# Altium schematic sheet Eload Gen 3 Control Module Rev 2.SchDoc
size A1; PageSetup: Record=PageOptions|CenterHorizontal=True|CenterVertical=True|PrintScale=1.00|XCorrection=1.00|YCorrection=1.00|PrintKind=1|BorderSize=5000000|LeftOffset=0|BottomOffset=0|Orientation=2|PaperLength=1000|PaperWidth=1000|Scale=100|PaperSource=7|PrintQuality=-3|MediaType=1|DitherType=10|PrintScaleMode=1|PaperKind=Letter 8.5"x11" 22x28cm|PaperIndex=1
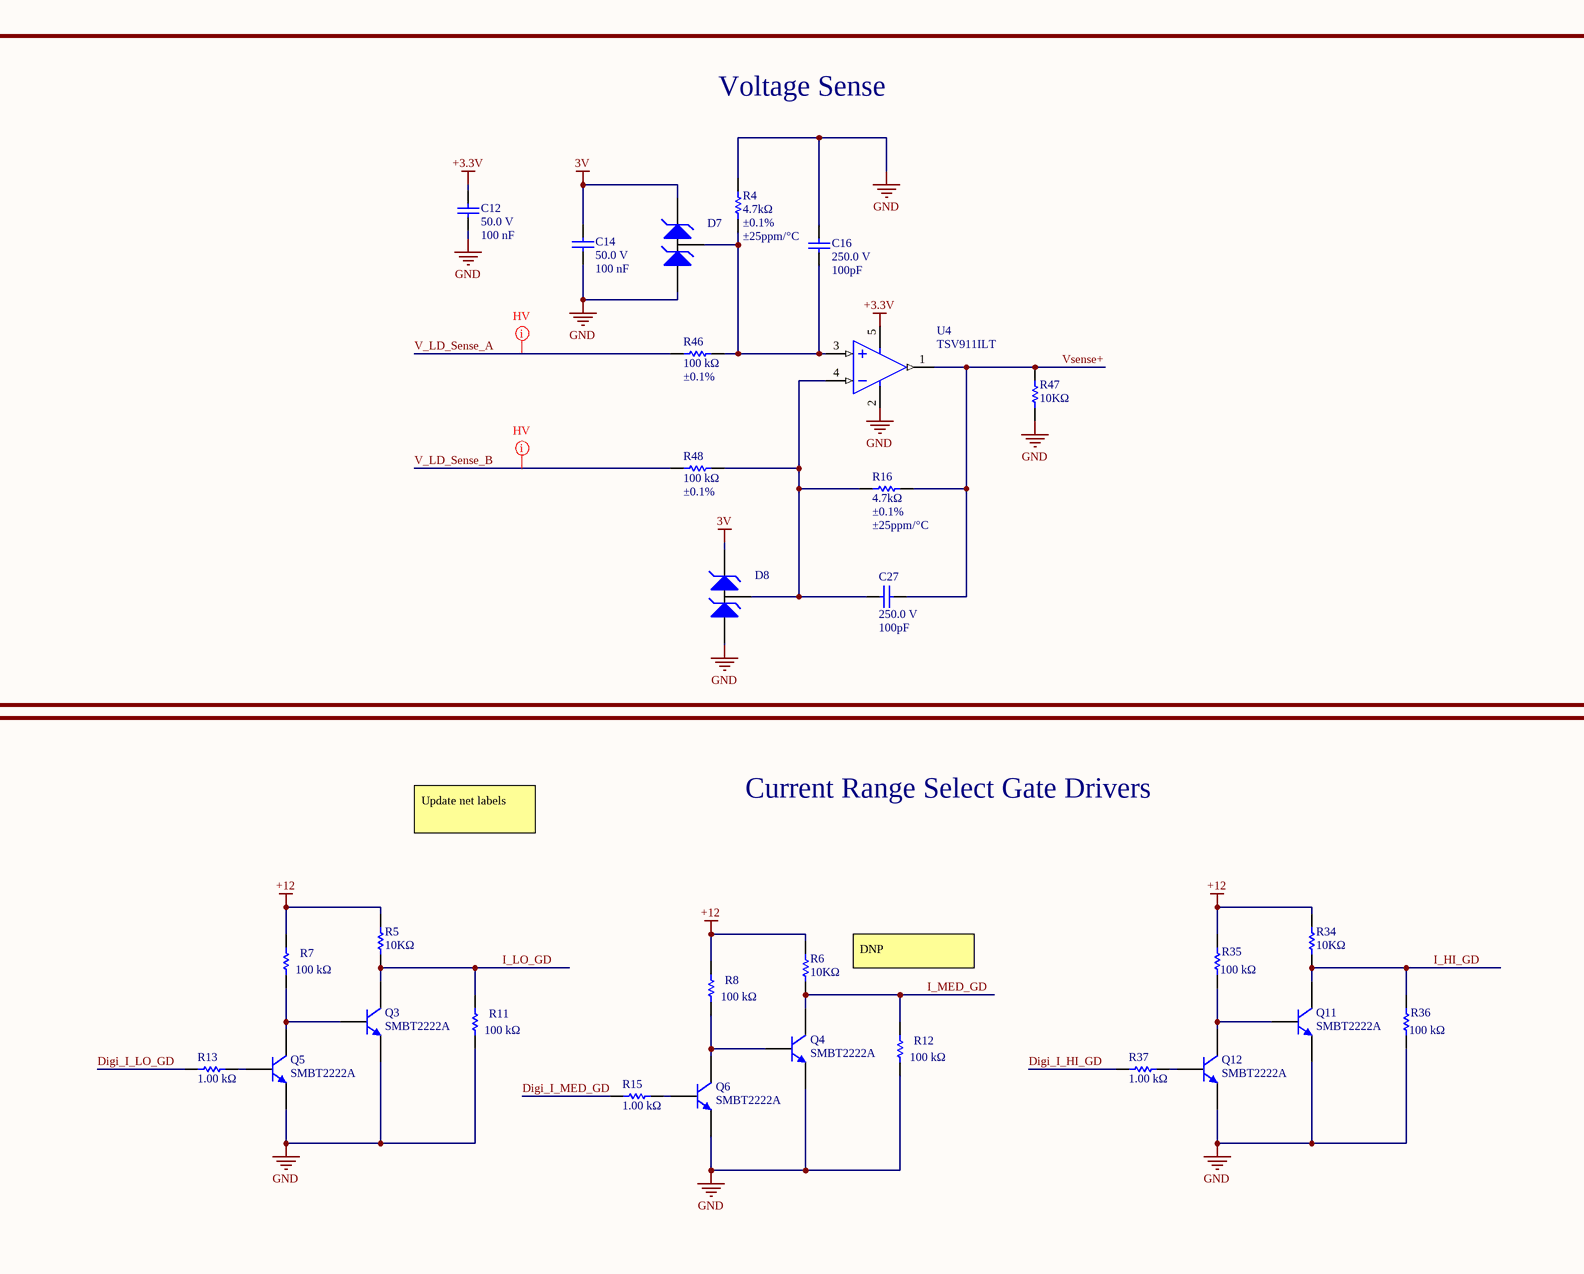
[diagram p0: Eload Gen 3 Control Module Rev 2.SchDoc, top left]
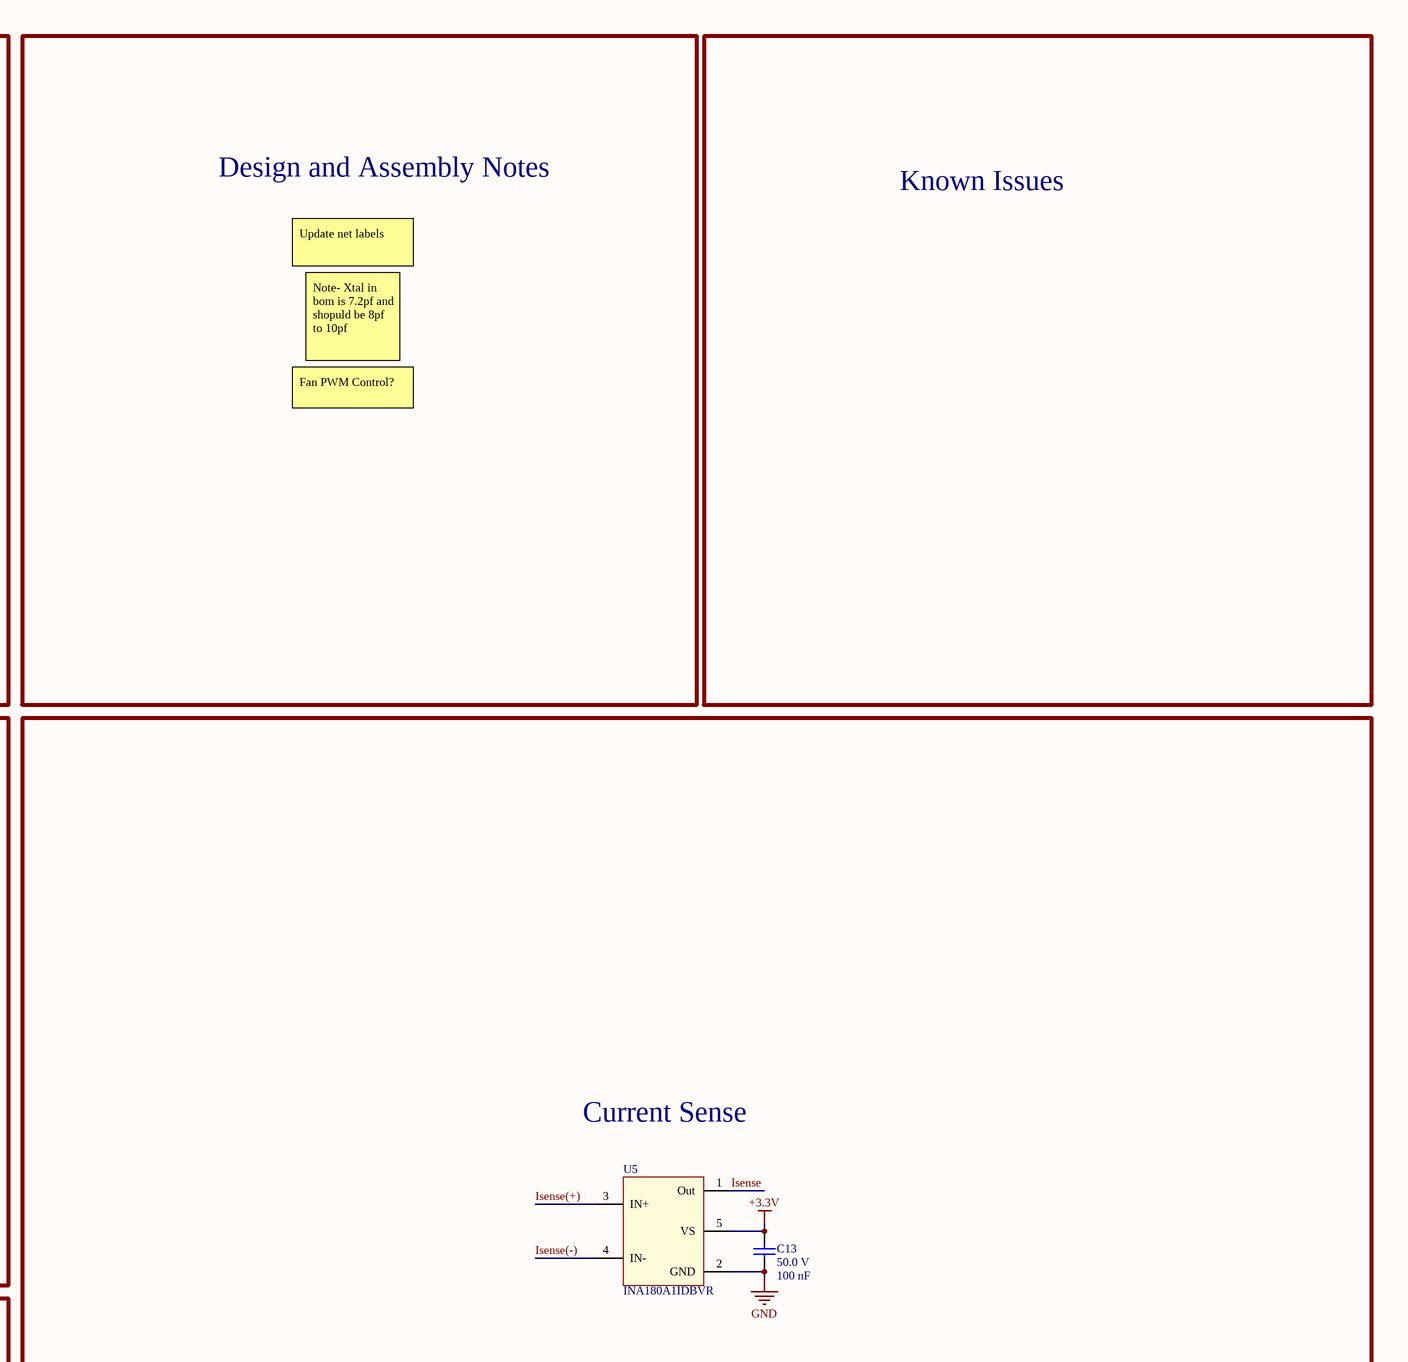
[diagram p1: Eload Gen 3 Control Module Rev 2.SchDoc, top right]
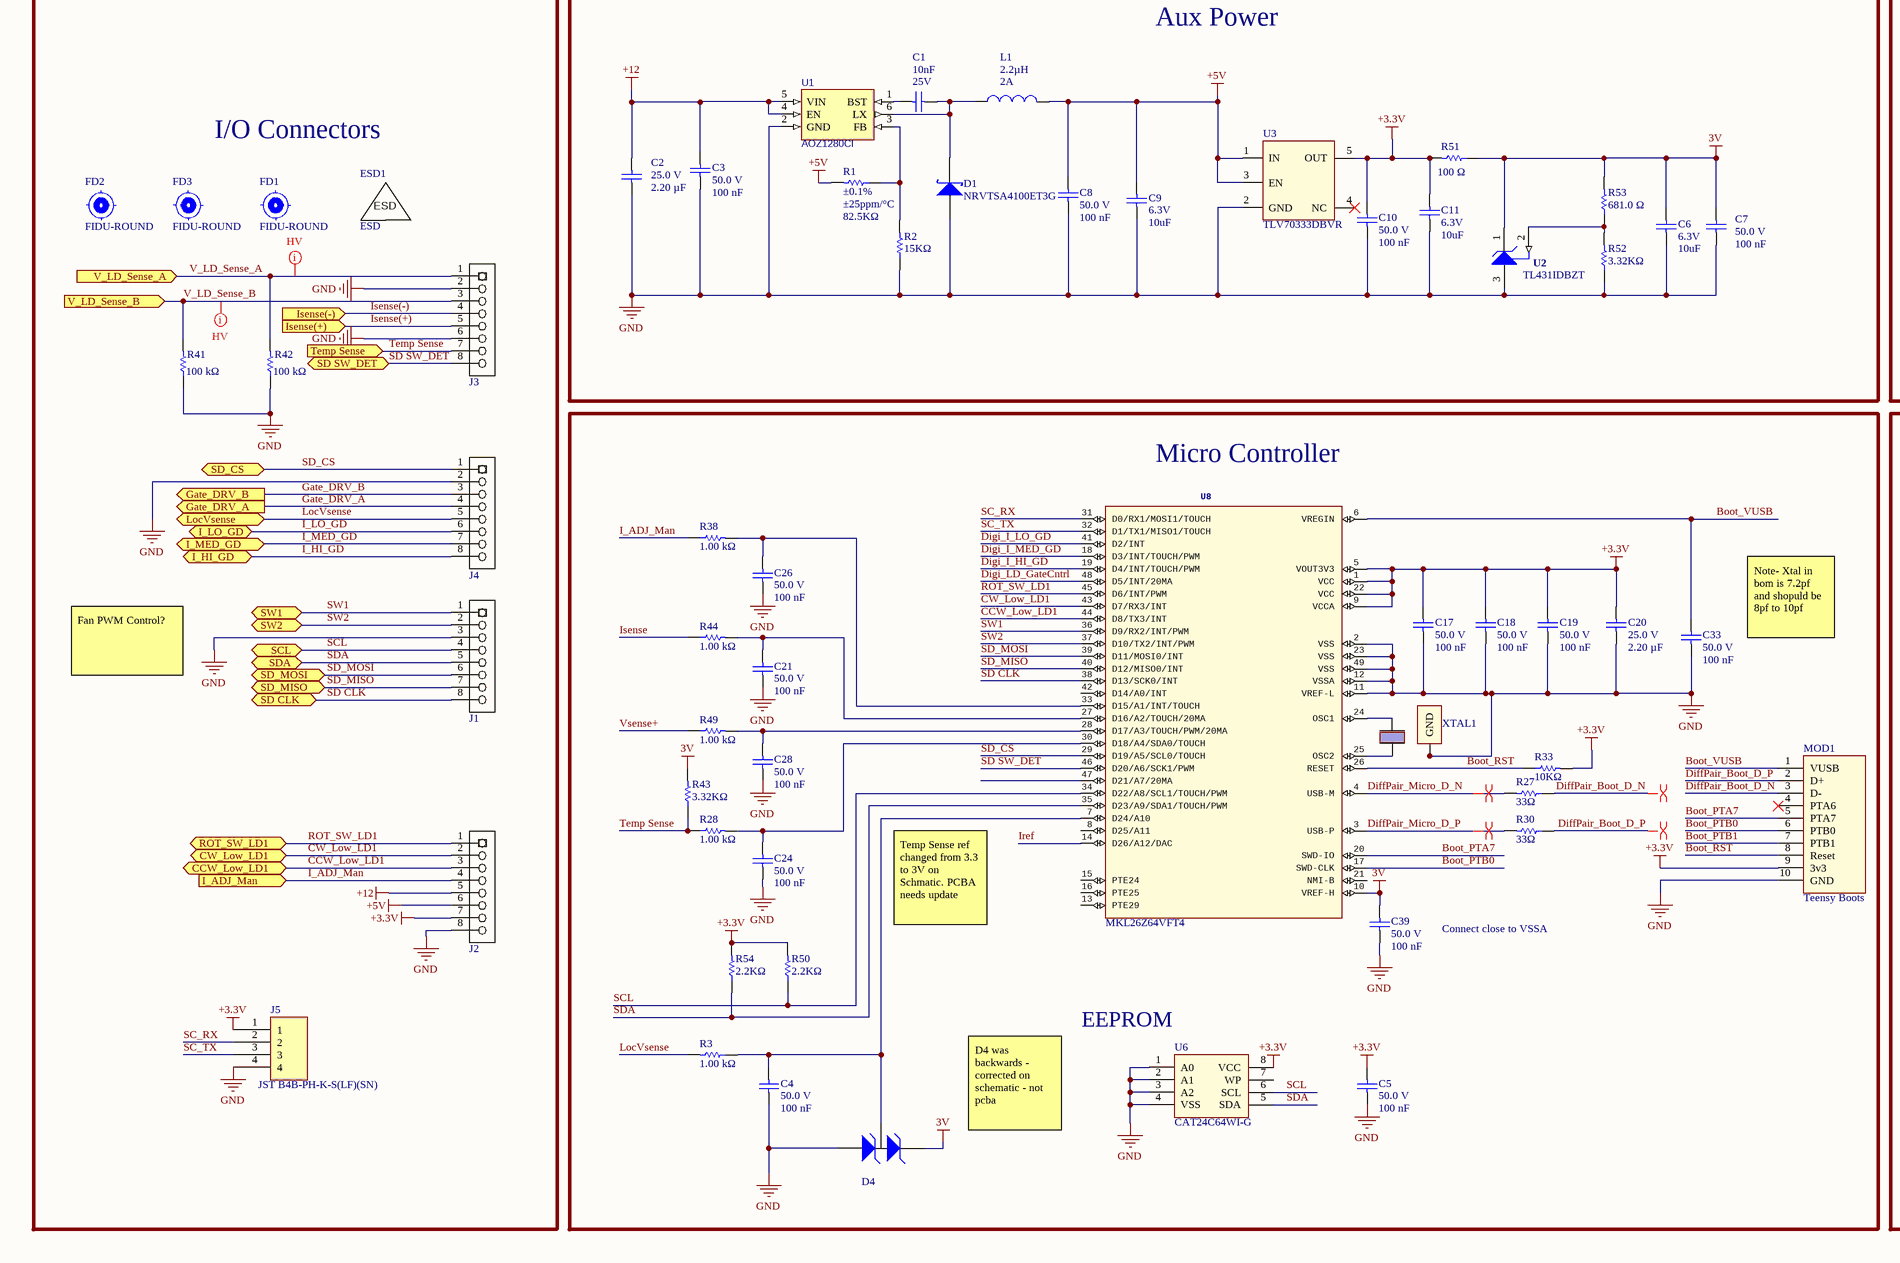
[diagram p2: Eload Gen 3 Control Module Rev 2.SchDoc, bottom left]
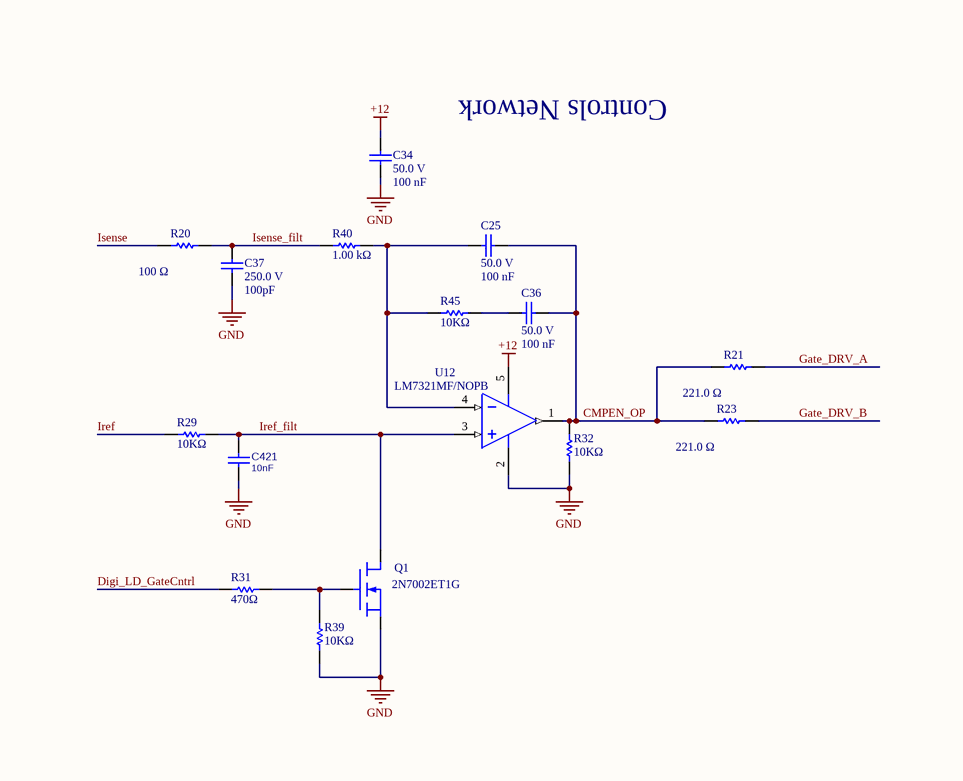
[diagram p3: Eload Gen 3 Control Module Rev 2.SchDoc, bottom right]

## Parts
C1  Voltage Rating (DC): 25V  Capacitance: 10nF  [Cap,0805]  (hidden comment: CL21B103KAANNNC)
C2  Voltage Rating (DC): 25.0 V  Capacitance: 2.20 µF  [CAP, 0805, HD]  (hidden comment: AVX 08053C225KAT2A)
C3  Voltage Rating (DC): 50.0 V  Capacitance: 100 nF  [CAP, 0805, HD]  (hidden comment: 08055C104JAT2A)
C4  Voltage Rating (DC): 50.0 V  Capacitance: 100 nF  [CAP, 0805, HD]  (hidden comment: 08055C104JAT2A)
C5  Voltage Rating (DC): 50.0 V  Capacitance: 100 nF  [Cap,0805]  (hidden comment: 08055C104JAT2A)
C6  Voltage - Rated: 6.3V  Capacitance: 10uF  [CAP, 0805, HD]  (hidden comment: CL21A106KQFNNNG)
C7  Voltage Rating (DC): 50.0 V  Capacitance: 100 nF  [CAP, 0805, HD]  (hidden comment: 08055C104JAT2A)
C8  Voltage Rating (DC): 50.0 V  Capacitance: 100 nF  [CAP, 0805, HD]  (hidden comment: 08055C104JAT2A)
C9  Voltage - Rated: 6.3V  Capacitance: 10uF  [CAP, 0805, HD]  (hidden comment: CL21A106KQFNNNG)
C10  Voltage Rating (DC): 50.0 V  Capacitance: 100 nF  [CAP, 0805, HD]  (hidden comment: 08055C104JAT2A)
C11  Voltage - Rated: 6.3V  Capacitance: 10uF  [CAP, 0805, HD]  (hidden comment: CL21A106KQFNNNG)
C12  Voltage Rating (DC): 50.0 V  Capacitance: 100 nF  [CAP, 0805, HD]  (hidden comment: 08055C104JAT2A)
C13  Voltage Rating (DC): 50.0 V  Capacitance: 100 nF  [CAP, 0805, HD]  (hidden comment: 08055C104JAT2A)
C14  Voltage Rating (DC): 50.0 V  Capacitance: 100 nF  [CAP, 0805, HD]  (hidden comment: 08055C104JAT2A)
C16  Voltage Rating (DC): 250.0 V  Capacitance: 100pF  [Cap,0805]  (hidden comment: GRM21A5C2E101JW01D)
C17  Voltage Rating (DC): 50.0 V  Capacitance: 100 nF  [Cap,0805]  (hidden comment: 08055C104JAT2A)
C18  Voltage Rating (DC): 50.0 V  Capacitance: 100 nF  [Cap,0805]  (hidden comment: 08055C104JAT2A)
C19  Voltage Rating (DC): 50.0 V  Capacitance: 100 nF  [Cap,0805]  (hidden comment: 08055C104JAT2A)
C20  Voltage Rating (DC): 25.0 V  Capacitance: 2.20 µF  [CAP, 0805, HD]  (hidden comment: AVX 08053C225KAT2A)
C21  Voltage Rating (DC): 50.0 V  Capacitance: 100 nF  [CAP, 0805, HD]  (hidden comment: 08055C104JAT2A)
C24  Voltage Rating (DC): 50.0 V  Capacitance: 100 nF  [CAP, 0805, HD]  (hidden comment: 08055C104JAT2A)
C25  Voltage Rating (DC): 50.0 V  Capacitance: 100 nF  [CAP, 0805, HD]  (hidden comment: 08055C104JAT2A)
C26  Voltage Rating (DC): 50.0 V  Capacitance: 100 nF  [CAP, 0805, HD]  (hidden comment: 08055C104JAT2A)
C27  Voltage Rating (DC): 250.0 V  Capacitance: 100pF  [Cap,0805]  (hidden comment: GRM21A5C2E101JW01D)
C28  Voltage Rating (DC): 50.0 V  Capacitance: 100 nF  [CAP, 0805, HD]  (hidden comment: 08055C104JAT2A)
C33  Voltage Rating (DC): 50.0 V  Capacitance: 100 nF  [Cap,0805]  (hidden comment: 08055C104JAT2A)
C34  Voltage Rating (DC): 50.0 V  Capacitance: 100 nF  [CAP, 0805, HD]  (hidden comment: 08055C104JAT2A)
C36  Voltage Rating (DC): 50.0 V  Capacitance: 100 nF  [CAP, 0805, HD]  (hidden comment: 08055C104JAT2A)
C37  Voltage Rating (DC): 250.0 V  Capacitance: 100pF  [Cap,0805]  (hidden comment: GRM21A5C2E101JW01D)
C39  Voltage Rating (DC): 50.0 V  Capacitance: 100 nF  [Cap,0805]  (hidden comment: 08055C104JAT2A)
C421  10nF  [Cap,0805]
D1  NRVTSA4100ET3G  [DO-214AC, SMA]
D4  BAT54SLT1G  [SOT23-3]  (value not drawn)
D7  BAT54SLT1G  [SOT23-3]  (value not drawn)
D8  BAT54SLT1G  [SOT23-3]  (value not drawn)
ESD1  ESD  [ESDSILK]
FD1  FIDU-ROUND  [FIDU-ROUND]
FD2  FIDU-ROUND  [FIDU-ROUND]
FD3  FIDU-ROUND  [FIDU-ROUND]
J1  HEADER,0.1",8Pin,SinlgeRow  [Header,8Pin,SingleRow, RA,0.1"]  (value not drawn)
J2  HEADER,0.1",8Pin,SinlgeRow  [Header,8Pin,SingleRow, RA,0.1"]  (value not drawn)
J3  HEADER,0.1",8Pin,SinlgeRow  [Header,8Pin,SingleRow, RA,0.1"]  (value not drawn)
J4  HEADER,0.1",8Pin,SinlgeRow  [Header,8Pin,SingleRow, RA,0.1"]  (value not drawn)
J5  JST B4B-PH-K-S(LF)(SN)  [Conn, JST, 4 pin, 2mm spacing]
L1  Inductance: 2.2µH  Current Rating (Amps): 2A  [IND,2520]  (hidden comment: CIGT252008LM2R2MNE)
MOD1  Teensy Boots  [Mod,Teensy Boots]
Q1  2N7002ET1G  [SOT23-3]
Q3  SMBT2222A  [SOT23-3]
Q4  SMBT2222A  [SOT23-3]
Q5  SMBT2222A  [SOT23-3]
Q6  SMBT2222A  [SOT23-3]
Q11  SMBT2222A  [SOT23-3]
Q12  SMBT2222A  [SOT23-3]
R1  Tolerance: ±0.1%  Temperature Coefficient: ±25ppm/°C  Resistance: 82.5KΩ  [res, 0805, HD]  (hidden comment: TNPW080582K5BEEA)
R2  Resistance: 15KΩ  [res, 0805, HD]  (hidden comment: CRGCQ0805F15K)
R3  Resistance: 1.00 kΩ  [res, 0805, HD]  (hidden comment: Vishay CRCW08051K00JNEA)
R4  Resistance: 4.7kΩ  Tolerance: ±0.1%  Temperature Coefficient: ±25ppm/°C  [res, 0805, HD]  (hidden comment: ERA-6AEB472V)
R5  Resistance: 10KΩ  [res, 0805, HD]  (hidden comment: Vishay / Dale CRCW080510K0FKTA)
R6  Resistance: 10KΩ  [res, 0805, HD]  (hidden comment: Vishay / Dale CRCW080510K0FKTA)
R7  Resistance: 100 kΩ  [res, 0805, HD]  (hidden comment: CRCW0805100KFKEA)
R8  Resistance: 100 kΩ  [res, 0805, HD]  (hidden comment: CRCW0805100KFKEA)
R11  Resistance: 100 kΩ  [res, 0805, HD]  (hidden comment: CRCW0805100KFKEA)
R12  Resistance: 100 kΩ  [res, 0805, HD]  (hidden comment: CRCW0805100KFKEA)
R13  Resistance: 1.00 kΩ  [res, 0805, HD]  (hidden comment: Vishay CRCW08051K00JNEA)
R15  Resistance: 1.00 kΩ  [res, 0805, HD]  (hidden comment: Vishay CRCW08051K00JNEA)
R16  Resistance: 4.7kΩ  Tolerance: ±0.1%  Temperature Coefficient: ±25ppm/°C  [res, 0805, HD]  (hidden comment: ERA-6AEB472V)
R20  Resistance: 100 Ω  [res, 0805, HD]  (hidden comment: CRCW0805100RJNEAC)
R21  Resistance: 221.0 Ω  [res, 0805, HD]  (hidden comment: Vishay Dale CRCW0805221RFKTA)
R23  Resistance: 221.0 Ω  [res, 0805, HD]  (hidden comment: Vishay Dale CRCW0805221RFKTA)
R27  Resistance: 33Ω  [res, 0805, HD]  (hidden comment: CR0805-JW-330ELF)
R28  Resistance: 1.00 kΩ  [res, 0805, HD]  (hidden comment: Vishay CRCW08051K00JNEA)
R29  Resistance: 10KΩ  [res, 0805, HD]  (hidden comment: Vishay / Dale CRCW080510K0FKTA)
R30  Resistance: 33Ω  [res, 0805, HD]  (hidden comment: CR0805-JW-330ELF)
R31  Resistance: 470Ω  [res, 0805, HD]  (hidden comment: CR0805-JW-471ELF)
R32  Resistance: 10KΩ  [res, 0805, HD]  (hidden comment: Vishay / Dale CRCW080510K0FKTA)
R33  Resistance: 10KΩ  [res, 0805, HD]  (hidden comment: Vishay / Dale CRCW080510K0FKTA)
R34  Resistance: 10KΩ  [res, 0805, HD]  (hidden comment: Vishay / Dale CRCW080510K0FKTA)
R35  Resistance: 100 kΩ  [res, 0805, HD]  (hidden comment: CRCW0805100KFKEA)
R36  Resistance: 100 kΩ  [res, 0805, HD]  (hidden comment: CRCW0805100KFKEA)
R37  Resistance: 1.00 kΩ  [res, 0805, HD]  (hidden comment: Vishay CRCW08051K00JNEA)
R38  Resistance: 1.00 kΩ  [res, 0805, HD]  (hidden comment: Vishay CRCW08051K00JNEA)
R39  Resistance: 10KΩ  [res, 0805, HD]  (hidden comment: Vishay / Dale CRCW080510K0FKTA)
R40  Resistance: 1.00 kΩ  [res, 0805, HD]  (hidden comment: Vishay CRCW08051K00JNEA)
R41  Resistance: 100 kΩ  [res, 0805, HD]  (hidden comment: CRCW0805100KFKEA)
R42  Resistance: 100 kΩ  [res, 0805, HD]  (hidden comment: CRCW0805100KFKEA)
R43  Resistance: 3.32KΩ  [res, 0805, HD]  (hidden comment: CRCW08053K32FKEA)
R44  Resistance: 1.00 kΩ  [res, 0805, HD]  (hidden comment: Vishay CRCW08051K00JNEA)
R45  Resistance: 10KΩ  [res, 0805, HD]  (hidden comment: Vishay / Dale CRCW080510K0FKTA)
R46  Resistance: 100 kΩ  Resistance Tolerance: ±0.1%  [res, 0805, HD]  (hidden comment: TE Connectivity RP73PF2A100KBTDF)
R47  Resistance: 10KΩ  [res, 0805, HD]  (hidden comment: Vishay / Dale CRCW080510K0FKTA)
R48  Resistance: 100 kΩ  Resistance Tolerance: ±0.1%  [res, 0805, HD]  (hidden comment: TE Connectivity RP73PF2A100KBTDF)
R49  Resistance: 1.00 kΩ  [res, 0805, HD]  (hidden comment: Vishay CRCW08051K00JNEA)
R50  Resistance: 2.2KΩ  [res, 0805, HD]  (hidden comment: CRCW08052K20FKEA)
R51  Resistance: 100 Ω  [res, 0805, HD]  (hidden comment: CRCW0805100RJNEAC)
R52  Resistance: 3.32KΩ  [res, 0805, HD]  (hidden comment: CRCW08053K32FKEA)
R53  Resistance: 681.0 Ω  [res, 0805, HD]  (hidden comment: CRCW0805681RFKEA)
R54  Resistance: 2.2KΩ  [res, 0805, HD]  (hidden comment: CRCW08052K20FKEA)
U1  AOZ1280CI  [SOT23-6]
U2  Manufacturer Part Number: TL431IDBZT  [SOT23-3]  (hidden comment: Shunt Regulator,2.5Vdc TL431IDBZT)
U3  TLV70333DBVR  [SOT23-5]
U4  TSV911ILT  [SOT23-5]
U5  INA180A1IDBVR  [SOT23-5]
U6  CAT24C64WI-G  [SOIC-8]
U8  MKL26Z64VFT4  [48-VFQFN Exposed Pad]
U12  LM7321MF/NOPB  [SOT23-5]
XTAL1  NX3225SA-16.000000MHZ-B3  [CRYSTAL,4-SMD, No Lead]  (value not drawn)

## Blocks framed on the sheet
Voltage Sense: C12 C14 C16 C27 D7 D8 R4 R16 R46-R48 U4
Current Range Select Gate Drivers: Q3-Q6 Q11 Q12 R5-R8 R11-R13 R15 R34-R37
Current Sense: C13 U5
I/O Connectors: ESD1 FD1-FD3 J1-J5 R41 R42
Aux Power: C1-C3 C6-C11 D1 L1 R1 R2 R51-R53 U1-U3
Micro Controller: C4 C5 C17-C21 C24 C26 C28 C33 C39 D4 MOD1 R3 R27 R28 R30 R33 R38 R43 R44 R49 R50 R54 U6 U8 XTAL1
Controls Network: C25 C34 C36 C37 C421 Q1 R20 R21 R23 R29 R31 R32 R39 R40 R45 U12

## Ports
CCW_Low_LD1, CW_Low_LD1, Gate_DRV_A (out), Gate_DRV_B (out), I_ADJ_Man (in), I_HI_GD, I_LO_GD, I_MED_GD, Isense(+) (in), Isense(-) (in), LocVsense, ROT_SW_LD1, SCL (bidir), SD CLK, SD SW_DET, SD_CS, SD_MISO, SD_MOSI, SDA (bidir), SW1, SW2, Temp Sense (in), V_LD_Sense_A (in), V_LD_Sense_B (in)

## Nets
3V: C6.2 C7.2 C14.2 C39.2 D4.2(K) D7.2(K) D8.2(K) R43.2 R51.1 R53.2 U2.1(CATHODE) U8.10(VREF-H)
+3.3V: C5.2 C10.2 C11.2 C12.2 C13.2 C17.2 C18.2 C19.2 C20.2 J2.7 J5.1 MOD1.9(3v3) R33.2 R50.2 R51.2 R54.2 U3.5(OUT) U4.5(+Vin) U5.5(VS) U6.8(VCC) U8.1(VCC) U8.5(VOUT3V3) U8.9(VCCA) U8.22(VCC)
+5V: C8.2 C9.2 J2.6 L1.2 R1.2 U3.1(IN) U3.3(EN)
+12: C2.2 C3.2 C34.2 J2.5 R5.2 R6.2 R7.2 R8.2 R34.2 R35.2 U1.4(EN) U1.5(VIN) U12.5(V+)
GND: C2.1 C3.1 C4.1 C5.1 C6.1 C7.1 C8.1 C9.1 C10.1 C11.1 C12.1 C13.1 C14.1 C16.1 C17.1 C18.1 C19.1 C20.1 C21.1 C24.1 C26.1 C28.1 C33.1 C34.1 C37.1 C39.1 C421.2 D1.2(A) D4.1(A) D7.1(A) D8.1(A) J1.3 J2.8 J3.2 J3.6 J4.2 J5.4 MOD1.10(GND) Q1.2(S) Q3.2(E) Q4.2(E) Q5.2(E) Q6.2(E) Q11.2(E) Q12.2(E) R2.1 R4.2 R11.1 R12.1 R32.1 R36.1 R39.1 R41.1 R42.1 R47.1 R52.1 U1.2(GND) U2.3(ANODE) U3.2(GND) U4.2(-Vin) U5.2(GND) U6.1(A0) U6.2(A1) U6.3(A2) U6.4(VSS) U8.2(VSS) U8.11(VREF-L) U8.12(VSSA) U8.23(VSS) U8.49(VSS) U12.2(V-) XTAL1.2(GND) XTAL1.4
Boot_PTA7: MOD1.5(PTA7) U8.20(SWD-IO)
Boot_PTB0: MOD1.6(PTB0) U8.17(SWD-CLK)
Boot_PTB1: MOD1.7(PTB1)
Boot_RST: MOD1.8(Reset) R33.1 U8.26(RESET)
Boot_VUSB: C33.2 MOD1.1(VUSB) U8.6(VREGIN)
CCW_Low_LD1: J2.3 U8.44(D8/TX3/INT) ; port CCW_Low_LD1
CMPEN_OP: C25.1 C36.1 R21.2 R23.2 R32.2 U12.1(OUT)
CW_Low_LD1: J2.2 U8.43(D7/RX3/INT) ; port CW_Low_LD1
DiffPair_Boot_D_N: MOD1.3(D-) R27.1
DiffPair_Boot_D_P: MOD1.2(D+) R30.1
DiffPair_Micro_D_N: R27.2 U8.4(USB-M)
DiffPair_Micro_D_P: R30.2 U8.3(USB-P)
Digi_I_HI_GD: R37.1 U8.19(D4/INT/TOUCH/PWM)
Digi_I_LO_GD: R13.1 U8.41(D2/INT)
Digi_I_MED_GD: R15.1 U8.18(D3/INT/TOUCH/PWM)
Digi_LD_GateCntrl: R31.2 U8.48(D5/INT/20MA)
Gate_DRV_A: J4.4 R21.1 ; port Gate_DRV_A
Gate_DRV_B: J4.3 R23.1 ; port Gate_DRV_B
I_ADJ_Man: J2.4 R38.1 ; port I_ADJ_Man
I_HI_GD: J4.8 Q11.3(C) R34.1 R36.2 ; port I_HI_GD
I_LO_GD: J4.6 Q3.3(C) R5.1 R11.2 ; port I_LO_GD
I_MED_GD: J4.7 Q4.3(C) R6.1 R12.2 ; port I_MED_GD
Iref: R29.2 U8.14(D26/A12/DAC)
Iref_filt: C421.1 Q1.3(D) R29.1 U12.3(IN+)
Isense: R20.2 R44.1 U5.1(Out)
Isense(+): J3.5 U5.3(IN+) ; port Isense(+)
Isense(-): J3.4 U5.4(IN-) ; port Isense(-)
Isense_filt: C37.2 R20.1 R40.1
LocVsense: J4.5 R3.2 ; port LocVsense
ROT_SW_LD1: J2.1 U8.45(D6/INT/PWM) ; port ROT_SW_LD1
SC_RX: J5.2 U8.31(D0/RX1/MOSI1/TOUCH)
SC_TX: J5.3 U8.32(D1/TX1/MISO1/TOUCH)
SCL: J1.4 R50.1 U6.6(SCL) U8.34(D22/A8/SCL1/TOUCH/PWM) ; port SCL
SD CLK: J1.8 U8.38(D13/SCK0/INT) ; port SD CLK
SD SW_DET: J3.8 U8.46(D20/A6/SCK1/PWM) ; port SD SW_DET
SD_CS: J4.1 U8.29(D19/A5/SCL0/TOUCH) ; port SD_CS
SD_MISO: J1.7 U8.40(D12/MISO0/INT) ; port SD_MISO
SD_MOSI: J1.6 U8.39(D11/MOSI0/INT) ; port SD_MOSI
SDA: J1.5 R54.1 U6.5(SDA) U8.35(D23/A9/SDA1/TOUCH/PWM) ; port SDA
SW1: J1.1 U8.36(D9/RX2/INT/PWM) ; port SW1
SW2: J1.2 U8.37(D10/TX2/INT/PWM) ; port SW2
Temp Sense: J3.7 R28.1 R43.1 ; port Temp Sense
V_LD_Sense_A: J3.1 R42.2 R46.1 ; port V_LD_Sense_A
V_LD_Sense_B: J3.3 R41.2 R48.1 ; port V_LD_Sense_B
Vsense+: C27.1 R16.1 R47.2 R49.1 U4.1(1OUT)
NetC1_1: C1.1 D1.1(K) L1.1 U1.6(LX)
NetC1_2: C1.2 U1.1(BST)
NetC4_2: C4.2 D4.3(AK) R3.1 U8.7(D24/A10)
NetC16_2: C16.2 D7.3(AK) R4.1 R46.2 U4.3(1IN+)
NetC21_2: C21.2 R44.2 U8.27(D16/A2/TOUCH/20MA)
NetC24_2: C24.2 R28.2 U8.30(D18/A4/SDA0/TOUCH)
NetC25_2: C25.2 R40.2 R45.2 U12.4(IN-)
NetC26_2: C26.2 R38.2 U8.33(D15/A1/INT/TOUCH)
NetC27_2: C27.2 D8.3(AK) R16.2 R48.2 U4.4(1IN-)
NetC28_2: C28.2 R49.2 U8.28(D17/A3/TOUCH/PWM/20MA)
NetC36_2: C36.2 R45.1
NetQ1_1: Q1.1(G) R31.1 R39.2
NetQ3_1: Q3.1(B) Q5.3(C) R7.1
NetQ4_1: Q4.1(B) Q6.3(C) R8.1
NetQ5_1: Q5.1(B) R13.2
NetQ6_1: Q6.1(B) R15.2
NetQ11_1: Q11.1(B) Q12.3(C) R35.1
NetQ12_1: Q12.1(B) R37.2
NetR1_1: R1.1 R2.2 U1.3(FB)
NetR52_2: R52.2 R53.1 U2.2(REF)
NetU8_24: U8.24(OSC1) XTAL1.1
NetU8_25: U8.25(OSC2) XTAL1.3

Not connected (* = marked no-connect by the designer): MOD1 4(PTA6)*; U3 4(NC)*; U6 7(WP); U8 8(D25/A11) 13(PTE29) 15(PTE24) 16(PTE25) 21(NMI-B) 42(D14/A0/INT) 47(D21/A7/20MA)

## Layout directives
HV_VSenseA: HV_VSenseA: V_LD_Sense_A, V_LD_Sense_B
differential pair: DiffPair_Boot_D_N, DiffPair_Boot_D_P, DiffPair_Micro_D_N, DiffPair_Micro_D_P
HV_VSenseB: HV_VSenseB: V_LD_Sense_B

## Notes on the sheet
- Design and Assembly Notes
- Known Issues
- Update net labels
- Note- Xtal in bom is 7.2pf and shopuld be 8pf to 10pf
- Fan PWM Control?
- DNP
- Temp Sense ref changed from 3.3 to 3V on Schmatic. PCBA needs update
- Connect close to VSSA
- (near U6) EEPROM
- D4 was backwards - corrected on schematic - not pcba

## Library data of the parts
C1 = Cap,0805,10nF,±10%,25Vdc: CAP CER 10000PF 25V X7R 0805; Manufacturer: Samsung Electro-Mechanics; Capacitance Tolerance: ±10%; Dielectric Material: Ceramic; Lead-Free Status: Lead Free; mfg P/N: C0805X102J1GACAUTO; Case/Package: 0805; Mounting Style: Surface Mount; REACH SVHC Compliance: No SVHC; RoHS: Compliant; Applications: General Purpose; Operating Temperature: -55°C ~ 125°C; Temperature Coefficient: X7R; Series: CL
C2 = Cap,0805,2.2uF,25V,±10%: 0805 2.2 uF 25 V ±10 % Tolerance X7R SMT Multilayer Ceramic Capacitor; Lead-Free Status: Lead Free; Case/Package (SI): 2012; Capacitance Tolerance: ±10%; REACH SVHC Compliance: No SVHC; Manufacturer Part Number: 08053C225KAT2A; Octopart URL: http://octopart.com/08053c225kat2a-avx-46506595; Case/Package: 0805; Mounting Style: Surface Mount; Dielectric Characteristic: X7R; RoHS: Compliant; Packaging: Cut Tape (CT), Tape & Reel (TR); Number of Pins: 2
C3-C5 C7 C8 C10 C12-C14 C17-C19 C21 C24-C26 C28 C33 C34 C36 C39 = Cap,0805,100nf,50V,5%,08055C104JAT2A: Capacitor; Ceramic; Cap 0.1 uF; Tol 5%; Vol-Rtg 50 VDC; SMT; 0805; X7R; Tape & Reel; Lead-Free Status: Lead Free; Case/Package (SI): 2012; Insulation Resistance: 100 GΩ; Detailed Description: 0.1µF ±5% 50V Ceramic Capacitor X7R 0805 (2012 Metric); Mounting Style: Surface Mount; Packaging: Tape & Reel (TR), Cut Tape (CT); RoHS: Compliant; Size-Width: 1.24 mm; Case/Package: 0805; Number of Pins: 2; digikey url: http://www.digikey.ca/product-detail/en/avx-corporation/08055C104JAT2A/478-3352-1-ND/930144; REACH SVHC Compliance: No SVHC; Dielectric Characteristic: X7R; Capacitance Tolerance: ±5%; Size-Length: 2.01 mm; Size-Height: 710 µm; Size-Thickness: 940 µm; Manufacturer Part Number: 08055C104JAT2A; Operating Temperature: -55°C ~ 125°C; Supplier 1: Digi-Key; Supplier Part Number 1: 478-3352-1-ND
  C3-C5 C8 C10 C12-C14 C17-C19 C21 C24-C26 C28 C33 C34 C36 C39: Octopart URL: http://octopart.com/08055c104jat2a-avx-55388010
C6 C9 C11 = Cap,0805,10uf,6.3V,10%,CL21A106KQFNNNG: CL21 Series 10 uF 6.3V ±10 % Tolerance X5R SMT Multilayer Ceramic Capacitor; Lead-Free Status: Lead Free; Tolerance: ±10%; Other Names: 1276-6457-2; RoHS: Compliant; mfg P/N: CL21A106KQFNNNG; Mounting Style: Surface Mount; Operating Temperature: -55°C ~ 85°C; Applications: General Purpose; Package / Case: 0805 (2012 Metric); Supplier 1: Digi-Key; Supplier Part Number 1: 1276-6457-1-ND
C16 C27 C37 = Cap,0805,100pf,250V,5%,GRM21A5C2E101JW01D: CAP CER 100PF 250V 5% NP0 0805; Dielectric Characteristic: C0G/NP0; Lead-Free Status: Lead Free; Capacitance Tolerance: ±5%; Case/Package: 0805; RoHS: Compliant; Size-Length: 0.002 m; Size-Thickness: 0.001 m; Size-Width: 0.00125 m; mfg P/N: GRM21A5C2E101JW01D; Supplier 1: Digi-Key; Supplier Part Number 1: 490-5542-1-ND; Supplier 2: LCSC; Supplier Part Number 2: C162304
C20 = Cap,0805,2.2uF,±10%,25V,08053C225KAT2A: 0805 2.2 uF 25 V ±10 % Tolerance X7R SMT Multilayer Ceramic Capacitor; Lead-Free Status: Lead Free; Case/Package (SI): 2012; Capacitance Tolerance: ±10%; REACH SVHC Compliance: No SVHC; Manufacturer Part Number: 08053C225KAT2A; Octopart URL: http://octopart.com/08053c225kat2a-avx-46506595; Case/Package: 0805; Mounting Style: Surface Mount; Dielectric Characteristic: X7R; RoHS: Compliant; Packaging: Cut Tape (CT), Tape & Reel (TR); Number of Pins: 2; Supplier 1: Digi-Key; Supplier Part Number 1: 478-5719-1-ND; Supplier 2: LCSC; Supplier Part Number 2: C167401
C421 = Cap,0805,10nF,10%,50V: Cap,SMD,10nF 50V X7R 10%,0805; Manufacturer: Kemet; Manufacturer P/N: C0805C103K5RACTU; P/N: 211-279-19; Not Stuffed: N/S; SMPC PN: 4300051; Fast Supplier: Digi-Key; Fast Supplier P/N: 399-1158-1-ND
D1 = Dio,Schottky,4A,400V,NRVTSA4100ET3G: Trench Schottky Rectifier, Very Low Leakage, 100V, 4A; Manufacturer: ON Semiconductor; Voltage - Forward (Vf) (Max) @ If: 680mV @ 4A; Speed: Fast Recovery =< 500ns, > 200mA (Io); Current - Reverse Leakage @ Vr: 9µA @ 100V; Capacitance @ Vr, F: 55pF @ 4V, 1MHz; mfg P\N: NRVTSA4100ET3G; Diode Type: Schottky; Voltage - DC Reverse (Vr) (Max): 100V; Current - Average Rectified (Io): 4A; Mounting Type: Surface Mount; Package / Case: DO-214AC, SMA; Supplier Device Package: SMA; Operating Temperature - Junction: -55°C ~ 175°C; Supplier 1: Digi-Key; Supplier Part Number 1: NRVTSA4100ET3GOSDKR-ND; Supplier 2: Digi-Key; Supplier Part Number 2: NRVTSA4100ET3GOSCT-ND
D4 D7 D8 = Diode,Shottky,Array,Series,30V,200mA,BAT54SLT1G: Diode Array 1 Pair Series Connection Schottky 30V 200mA (DC) Surface Mount TO-236-3, SC-59, SOT-23-3; Manufacturer: ON Semiconductor; Voltage - Forward (Vf) (Max) @ If: 800mV @ 100mA; Speed: Small Signal =< 200mA (Io), Any Speed; Reverse Recovery Time (trr): 5ns; Current - Reverse Leakage @ Vr: 2µA @ 25V; Detailed Description: Diode Array 1 Pair Series Connection Schottky 30V 200mA (DC) Surface Mount TO-236-3, SC-59, SOT-23-3; mfg P/N: BAT54SLT1G; Diode Type: Schottky; Diode Configuration: 1 Pair Series Connection; Voltage - DC Reverse (Vr) (Max): 30V; Current - Average Rectified (Io) (per Diode): 200mA (DC); Operating Temperature - Junction: 125°C (Max); Mounting Type: Surface Mount; Package / Case: TO-236-3, SC-59, SOT-23-3; Supplier Device Package: SOT-23-3 (TO-236); Base Part Number: BAT54SL; Supplier 1: Digi-Key; Supplier Part Number 1: BAT54SLT1GOSCT-ND; Supplier 2: LCSC; Supplier Part Number 2: C19726
ESD1 = ESD: ESD LOGO
FD1-FD3 = FIDU-ROUND: ROUND FIDUCIAL
J5 = Conntector, though hole, JST, 4pin, 2mm,B4B-PH-K-S(LF)(SN): PH Series 4 Position 2 mm Pitch Through Hole Crimp Top Entry Shrouded Header; Voltage Rating (AC): 100 V; Insulation Resistance: 1.00 MΩ; Number of Contacts: 4; Contact Resistance: 10.0 mΩ; REACH SVHC Compliance: No SVHC; Mounting Style: Through Hole, Vertical; Manufacturer Part Number: B4B-PH-K-S(LF)(SN); Size-Width: 4.50 mm; Number of Positions: 4; Size-Height: 6.00 mm; Size-Length: 9.90 mm; Supplier 1: Farnell; Supplier 2: Newark; Supplier 3: Digi-Key; Supplier 4: Digi-Key; Supplier Part Number 4: 455-1706-ND
L1 = IND,2025,2.2u,2A,97mOhm,CIGT252008LM2R2MNE: FIXED IND 2.2UH 2A 97MOHM SMD; Manufacturer: Samsung Electro-Mechanics; Type: Thin Film; Material - Core: Metal Composite; Tolerance: ±20%; Current - Saturation: 2.1A; Shielding: Unshielded; DC Resistance (DCR): 97mOhm Max; Inductance Frequency - Test: 1MHz; mfg P\N: CIGT252008LM2R2MNE; Operating Temperature: -40°C ~ 125°C; Mounting Type: Surface Mount; Package / Case: 1008 (2520 Metric)
MOD1 = Module,Teensy Boots,Programming
Q1 = MOSFET,N-Channel,SOT23,0.25A,60V,2N7002ET1G: Small Signal MOSFET, 60 V, 310 mA, Single, N-Channel, 3-Pin SOT-23, Pb-Free, Tape and Reel; Manufacturer: ON Semiconductor; Continuous Drain Current (Ids): 0.25A; Lead-Free Status: Lead Free; Drain to Source Voltage (Vds): 60.0 V; Power Dissipation (Max): 350mW (Ta); REACH SVHC Compliance: No SVHC; Number of Pins: 3; Halogen Free Status: Halogen Free; Case/Package: SOT-23-3; Polarity: N-Channel; RoHS: Compliant; Lifecycle Status: Active; Manufacturer Part Number: 2N7002ET1G; Supplier 1: Digi-Key; Supplier Part Number 1: 2N7002ET1GOSCT-ND; Supplier 2: LCSC; Supplier Part Number 2: C71533
Q3-Q6 Q11 Q12 = Trans,40V,600mA,0.33W, SMBT2222A: NPN Silicon Switching Transistor, 40 V VCEO, 600 mA IC, SOT23, Reel, Green; Power Dissipation: 0.33 W; Voltage - Collector Emitter Breakdown (Max): 40V; Vce Saturation (Max) @ Ib, Ic: 1V @ 50mA, 500mA; Current - Collector Cutoff (Max): 10nA (ICBO); DC Current Gain (hFE) (Min) @ Ic, Vce: 100 @ 150mA, 10V; Frequency - Transition: 300MHz; Mounting Style: Surface Mount; Number of Pins: 3; Packaging: Cut Tape (CT); Polarity: NPN; REACH SVHC Compliance: No SVHC; RoHS: Compliant; mfg P/N: SMBT2222A; Mounting Type: Surface Mount; Package / Case: TO-236-3, SC-59, SOT-23-3; Supplier Device Package: SOT-23-3; Supplier 1: Digi-Key; Supplier Part Number 1: SMBT2222AE6327HTSA1CT-ND; Supplier 2: Digi-Key; Supplier Part Number 2: MMBT2222ALT1HTSA1CT-ND; Supplier 3: Digi-Key; Supplier Part Number 3: SMBT2222AE6327HTSA1DKR-ND; Supplier 4: LCSC; Supplier Part Number 4: C151510
R1 = Res,0805,82.5KΩ,0.1%,25ppm, TNPW080582K5BEEA: 82.5 kOhms ±0.1% 0.2W, 1/5W Chip Resistor 0805 (2012 Metric) Anti-Sulfur, Automotive AEC-Q200, Moisture Resistant Thin Film; Manufacturer: Vishay Dale; mfg P/N: TNPW080582K5BEEA; Power (Watts): 0.2W, 1/5W; Composition: Thin Film; Features: Anti-Sulfur, Automotive AEC-Q200, Moisture Resistant; Operating Temperature: -55°C ~ 155°C; Package / Case: 0805 (2012 Metric); Supplier Device Package: 0805; Supplier 1: Digi-Key; Supplier Part Number 1: 541-3231-1-ND
R2 = Res,0805,15KΩ,1%,±100ppm/°C,CRGCQ0805F15K: 15 kOhms ±1% 0.125W, 1/8W Chip Resistor 0805 (2012 Metric) Automotive AEC-Q200, Moisture Resistant Thick Film; mfg P/N: CRGCQ0805F15K; Tolerance: ±1%; Power (Watts): 0.125W, 1/8W; Composition: Thick Film; Features: Automotive AEC-Q200, Moisture Resistant; Temperature Coefficient: ±100ppm/°C; Operating Temperature: -55°C ~ 155°C; Package / Case: 0805 (2012 Metric); Supplier Device Package: 0805; Supplier 1: Digi-Key; Supplier Part Number 1: A129763CT-ND
R3 R13 R15 R28 R37 R38 R40 R44 R49 = Res,0805,1.00 kΩ,5%,200ppm,CRCW08051K00JNEA: Res Thick Film 0805 1K Ohm 5% 0.125W(1/8W) ±200ppm/C Molded SMD Automotive Paper T/R; Power Rating: 125 mW; Case/Package (SI): 2012; Lead-Free Status: Lead Free; Temperature Coefficient: 200 ppm/°C; Voltage Rating (DC): 150 V; Size-Width: 1.25 mm; Mounting Style: Surface Mount; REACH SVHC Compliance: No SVHC; Manufacturer Part Number: CRCW08051K00JNEA; Number of Pins: 2; Size-Height: 450 µm; Packaging: Tape & Reel (TR), Cut Tape (CT); RoHS: Compliant; Resistance Tolerance: ±5%; Case/Package: 0805; Size-Length: 2.00 mm; Supplier 1: Digi-Key; Supplier Part Number 1: 541-1.0KADKR-ND; Supplier 2: Digi-Key; Supplier Part Number 2: 541-1.0KACT-ND
R4 R16 = Res,0805,4.7KΩ,0.1%,±25ppm/°C,ERA-6AEB472V: RES 4.7K OHM 0.1% 1/8W 0805; Manufacturer: Panasonic Electronic Components; Detailed Description: 4.7 kOhms ±0.1% 0.125W, 1/8W Chip Resistor 0805 (2012 Metric) Automotive AEC-Q200 Thin Film; Categories: Resistors   Chip Resistor - Surface Mount; Power (Watts): 0.125W, 1/8W; mfg P/N: ERA-6AEB472V; Series: ERA-6A; Part Status: Active; Composition: Thin Film; Features: Automotive AEC-Q200; Operating Temperature: -55°C ~ 155°C; Package / Case: 0805 (2012 Metric); Ratings: AEC-Q200; Supplier Device Package: 0805; Size / Dimension: 0.079" L x 0.049" W (2.00mm x 1.25mm); Height - Seated (Max): 0.024" (0.60mm); Number of Terminations: 2; Supplier 1: Digi-Key; Supplier Part Number 1: P4.7KDACT-ND
R5 R6 R29 R32-R34 R39 R45 R47 = Res,0805,10.0kΩ,1%,100 ppm,CRCW080510K0FKTA: RES SMD 10K OHM 1% 1/8W 0805; Temperature Coefficient: 100.0 ppm/C; Lead-Free Status: Contains Lead; Voltage Rating (DC): 150.0 V; Power Rating: 0.125 W; Case/Package (SI): 2012; Size-Width: 0.00125 m; Resistance Tolerance: 1%; Size-Length: 0.002 m; RoHS: Non-Compliant; Power Dissipation: 0.125 W; Number of Pins: 2; REACH SVHC Compliance: No SVHC; Size-Height: 0.00045 m; Case/Package: 0805; Mounting Style: Surface Mount; Supplier 1: Digi-Key; Supplier Part Number 1: 541-3016-1-ND
R7 R8 R11 R12 R35 R36 R41 R42 = Res,0805,100kΩ,1%,100ppm,CRCW0805100KFKEA: 100 kOhms ±1% 0.125W, 1/8W Chip Resistor 0805 (2012 Metric) Thick Film; Manufacturer: Vishay; Lead-Free Status: Lead Free; Case/Package (SI): 2012; Power Rating: 125 mW; Temperature Coefficient: -100 ppm/°C to 100 ppm/°C; Resistance Tolerance: ±1%; RoHS: Compliant; Manufacturer Part Number: CRCW0805100KFKEA; Number of Pins: 2; Size-Length: 2.00 mm; Packaging: Tape & Reel (TR), Reel, Cut Tape (CT); Size-Height: 450 µm; Case/Package: 0805; Size-Width: 1.25 mm; Operating Temperature: 150 °C (max); Supplier 1 Part Number: 679-0803; Supplier 1: RS; Supplier 2: Digi-Key; Supplier Part Number 2: 541-100KCCT-ND
R20 R51 = Res,0805,100Ω,5%,±200ppm/°C: RES 100 OHM 5% 1/8W 0805; Lead-Free Status: Lead Free; Power Rating: 0.125 W; Detailed Description: 100 Ohms ±5% 0.125W, 1/8W Chip Resistor 0805 (2012 Metric) Thick Film; Case/Package: 0805 (2012 Metric); Number of Pins: 2; RoHS: Compliant; mfg P/N: CRCW0805100RJNEAC; Tolerance: ±5%; Temperature Coefficient: ±200ppm/°C; Operating Temperature: -55°C ~ 155°C; Supplier 1: Digi-Key; Supplier Part Number 1: 541-100ACT-ND
R21 R23 = Res,0805,221Ω,1%,100ppm,CRCW0805221RFKTA: RES SMD 221 OHM 1% 1/8W 0805; Case/Package (SI): 2012; Lead-Free Status: Contains Lead; Power Dissipation: 0.125 W; Temperature Coefficient: 100.0 ppm/°C; Voltage Rating (DC): 150.0 V; Case/Package: 0805; Mounting Style: Surface Mount; Number of Pins: 2; Power Rating: 0.125 W; Resistance Tolerance: ±1%; RoHS: Non-Compliant; Size-Height: 0.00045 m; Size-Length: 0.002 m; Size-Width: 0.00125 m; Supplier 1: Digi-Key; Supplier Part Number 1: 541-221CCT-ND
R27 R30 = Res,0805,33Ω,±5%,200ppm,CR0805-JW-330ELF: RES SMD 33 OHM 5% 1/8W 0805; Manufacturer: Bourns Inc.; Detailed Description: 33 Ohms ±5% 0.125W, 1/8W Chip Resistor 0805 (2012 Metric) Moisture Resistant Thick Film; Categories: Resistors   Chip Resistor - Surface Mount; Power (Watts): 0.125W, 1/8W; Temperature Coefficient: ±200ppm/°C; mfg P/N: CR0805-JW-330ELF; Series: CR0805; Part Status: Active; Tolerance: ±5%; Composition: Thick Film; Features: Moisture Resistant; Operating Temperature: -55°C ~ 155°C; Package / Case: 0805 (2012 Metric); Supplier Device Package: 0805; Size / Dimension: 0.079" L x 0.049" W (2.00mm x 1.25mm); Height - Seated (Max): 0.024" (0.60mm); Number of Terminations: 2; Base Part Number: CR0805; Supplier 1: Digi-Key; Supplier Part Number 1: 118-CR0805-JW-330ELFCT-ND
R31 = res,0805,470Ω,5%,200ppm,CR0805-JW-471ELF: RES SMD 470 OHM 5% 1/8W 0805; Manufacturer: Bourns Inc.; Detailed Description: 470 Ohms ±5% 0.125W, 1/8W Chip Resistor 0805 (2012 Metric) Moisture Resistant Thick Film; Categories: Resistors   Chip Resistor - Surface Mount; Power (Watts): 0.125W, 1/8W; Temperature Coefficient: ±200ppm/°C; mfg P/N: CR0805-JW-471ELF; Part Status: Active; Tolerance: ±5%; Composition: Thick Film; Features: Moisture Resistant; Operating Temperature: -55°C ~ 155°C; Package / Case: 0805 (2012 Metric); Supplier Device Package: 0805; Size / Dimension: 0.079" L x 0.049" W (2.00mm x 1.25mm); Height - Seated (Max): 0.024" (0.60mm); Number of Terminations: 2; Base Part Number: CR0805; Supplier 1: Digi-Key; Supplier Part Number 1: 118-CR0805-JW-471ELFCT-ND
R43 R52 = Res,0805,3.32K,±1%,100.0 ppm/°C,150.0 V,CRCW08053K32FKEA: RES SMD 3.32K OHM 1% 1/8W 0805; Case/Package (SI): 2012; Lead-Free Status: Lead Free; Power Rating: 0.125 W; Voltage Rating (DC): 150.0 V; Case/Package: 0805; Mounting Style: Surface Mount; Number of Pins: 2; REACH SVHC Compliance: No SVHC; Resistance Tolerance: ±1%; RoHS: Compliant; Size-Height: 0.00045 m; Size-Length: 0.002 m; Size-Width: 0.00125 m; Temperature Coefficient: 100.0 ppm/°C; mfg P/N: CRCW08053K32FKEA; Supplier 1: Digi-Key; Supplier Part Number 1: 541-3.32KCCT-ND
R46 R48 = Res,0805,100 kΩ,0.1%,25ppm,RP73PF2A100KBTDF: Surface Mount Thin Film Resistor, RP73 Series, 100 kohm, 250 mW, - 0.1%, 150 V; Voltage Rating (DC): 150 V; Power Rating: 250 mW; ELV Compliant: Compliant; Temperature Coefficient: ±25ppm/°C; RoHS: Compliant; Manufacturer Part Number: RP73PF2A100KBTDF; Case/Package: 0805, 2012; Mounting Style: Surface Mount; Lifecycle Status: Active; Packaging: Tape & Reel (TR); REACH SVHC Compliance: No SVHC; Supplier 1: Digi-Key; Supplier Part Number 1: A110735CT-ND
R50 R54 = Res,0805,2.2KΩ,±1%,100.0 ppm/°C,150.0 V,CRCW08052K20FKEA: RES SMD 2.2K OHM 1% 1/8W 0805; Case/Package (SI): 2012; Lead-Free Status: Lead Free; Power Rating: 0.125 W; Voltage Rating (DC): 150.0 V; Case/Package: 0805; Mounting Style: Surface Mount; Number of Pins: 2; REACH SVHC Compliance: No SVHC; Resistance Tolerance: ±1%; RoHS: Compliant; Size-Height: 0.00045 m; Size-Length: 0.002 m; Size-Width: 0.00125 m; Temperature Coefficient: 100.0 ppm/°C; mfg P/N: CRCW08052K20FKEA; Supplier 1: Digi-Key; Supplier Part Number 1: 541-2.20KCCT-ND
R53 = Res,0805,681.0 Ω,±1%,100.0 ppm/°C,150.0 V,CRCW0805681RFKEA: RES SMD 681 OHM 1% 1/8W 0805; Case/Package (SI): 2012; Lead-Free Status: Lead Free; Power Rating: 0.125 W; Voltage Rating (DC): 150.0 V; Case/Package: 0805; Mounting Style: Surface Mount; Number of Pins: 2; Octopart Url: https://octopart.com/crcw0805681rfkea-vishay-39820193; REACH SVHC Compliance: No SVHC; Resistance Tolerance: ±1%; RoHS: Compliant; Size-Height: 0.00045 m; Size-Length: 0.002 m; Size-Width: 0.00125 m; Temperature Coefficient: 100.0 ppm/°C; mfg P/N: CRCW0805681RFKEA; Supplier 1: Digi-Key; Supplier Part Number 1: 541-681CCT-ND
U1 = Controller,Buck Reg,3-26V,1.2A,SOT23,AOZ1280CI: IC REG BUCK ADJ 1.2A SOT23-6; Manufacturer: Alpha & Omega Semiconductor Inc.; Detailed Description: Buck Switching Regulator IC Positive Adjustable 0.8V 1 Output 1.2A SOT-23-6; Categories: Integrated Circuits (ICs)   PMIC - Voltage Regulators - DC DC Switching Regulators; Function: Step-Down; Output Configuration: Positive; Output Type: Adjustable; Number of Outputs: 1; Voltage - Input (Min): 3V; Voltage - Input (Max): 26V; Voltage - Output (Min/Fixed): 0.8V; Frequency - Switching: 1.5MHz; Synchronous Rectifier: No; Supplier 1: LCSC; Supplier Part Number 1: C41240; Supplier 2: Digi-Key; Supplier Part Number 2: 785-1277-1-ND; mfg P/N: AOZ1280CI; Series: EZBuck™; Part Status: Active; Topology: Buck; Voltage - Output (Max): 26V; Current - Output: 1.2A; Operating Temperature: -40°C ~ 85°C (TA); Mounting Type: Surface Mount; Package / Case: SOT-23-6; Supplier Device Package: SOT-23-6
U2 = Shunt Regulator,2.5Vdc TL431IDBZT: Adjustable Precision Shunt Regulator, 34 ppm / degC, 100 mA, -40 to 85 degC, 3-pin SOT-23 (DBZ), Green (RoHS & no Sb/Br); Lead-Free Status: Lead Free; Output Current: 0.1 A; Temperature Coefficient: 34.0 ppm/°C; Case/Package: SOT-23; Lifecycle Status: Active; Number of Pins: 3; Octopart Url: https://octopart.com/tl431idbzt-texas+instruments-843706; OctopartID: acb465b256687373; Packaging: Cut Tape (CT); RoHS: Compliant; Supplier 1: Digi-Key; Supplier Part Number 1: 296-26719-1-ND
U3 = Reg, LDO, 3.3V fixed, 5.5-3.3Vdc In, 0.3mA,TLV703: IC REG LINEAR 3.3V 300MA SOT23-5; Output Configuration: Positive; Output Type: Fixed; Number of Regulators: 1; Control Features: Current Limit; Voltage - Input (Max): 5.5V; Voltage Dropout (Max): 0.375V @ 300mA; Current - Quiescent (Iq): 55µA; Current - Supply (Max): 370µA; PSRR: 68dB (1kHz); Protection Features: Over Current; mfg P/N: TLV70333DBVR; Current - Output: 300mA; Voltage - Output (Min/Fixed): 3.3V; Operating Temperature: -40°C ~ 125°C (TJ); Mounting Type: Surface Mount; Package / Case: SC-74A, SOT-753; Supplier Device Package: SOT-23-5; Supplier 1: Digi-Key; Supplier Part Number 1: 296-47851-1-ND
U4 = Opamp,SOT5, 8Mhz, Rail to Rail, TSV911ILT: General Purpose Amplifier 1 Circuit Rail-to-Rail SOT-23-5; Amplifier: Type General Purpose; Number of Circuits: 1; Slew Rate: 4.5 V/µs; Gain Bandwidth Product: 8MHz; Current - Input Bias: 1pA; Voltage - Input Offset: 100µV; Current - Supply: 820µA; Current - Output / Channel: 35mA; Voltage - Supply, Single/Dual (±): 2.5 V ~ 5.5 V; Output Type: Rail-to-Rail; Operating Temperature: -40°C ~ 125°C; Mounting Type: Surface Mount; Package / Case: SC-74A, SOT-753; Supplier Device Package: SOT-23-5; mfg P/N: TSV911ILT; Supplier 1: Digi-Key; Supplier Part Number 1: 497-6000-1-ND
U5 = OPAMP,CurrentMon,20V/V,350kHz,SOT-23-5,I INA180A1IDBVR: Current Sense Amplifier 1 Circuit Rail-to-Rail SOT-23-5; Manufacturer: Texas Instruments; Slew Rate: 2V/µs; Current - Supply: 260µA; Voltage - Supply, Single/Dual (±): 2.7V ~ 5.5V; Number of Circuits: 1; Gain Bandwidth Product: 350kHz; Current - Input Bias: 80µA; Voltage - Input Offset: 100µV; mfg P/N: INA180A1IDBVR; Detailed Description: Current Sense Amplifier 1 Circuit Rail-to-Rail SOT-23-5; Series: Automotive, AEC-Q100; Part Status: Active; Amplifier Type: Current Sense; Output Type: Rail-to-Rail; Operating Temperature: -40°C ~ 125°C (TA); Mounting Type: Surface Mount; Package / Case: SC-74A, SOT-753; Supplier Device Package: SOT-23-5; Supplier 1: Digi-Key; Supplier Part Number 1: 296-47652-1-ND; Supplier 2: LCSC; Supplier Part Number 2: C122228
U6 = IC,EEPROM,64Kb,1Mhz,SOIC8, CAT24C64WI-G: IC EEPROM 64K I2C 1MHZ 8SOIC; Manufacturer: ON Semiconductor; Detailed Description: EEPROM Memory IC 64Kb (8K x 8) I²C 1MHz 400ns 8-SOIC; Memory Type: Non-Volatile; Memory Size: 64Kb (8K x 8); Memory Interface: I²C; Write Cycle Time - Word, Page: 5ms; Voltage - Supply: 1.7V ~ 5.5V; Access Time: 400ns; mfg P/N: CAT24C64WI-G; Category: Integrated Circuits (ICs)  Memory; Part Status: Active; Memory Format: EEPROM; Technology: EEPROM; Operating Temperature: -40°C ~ 85°C (TA); Mounting Type: Surface Mount; Package / Case: 8-SOIC (0.154"", 3.90mm Width); Supplier Device Package: 8-SOIC; Clock Frequency: 1MHz; Supplier 1: Digi-Key; Supplier Part Number 1: CAT24C64WI-GT3CT-ND; Supplier 2: LCSC; Supplier Part Number 2: C13645
U8 = Micro,Teensy,48Mhz,32Bit,64KB,MKL26Z64VFT4: IC MCU 32BIT 64KB FLASH 48QFN; Manufacturer: NXP USA Inc.; Detailed Description: ARM® Cortex®-M0+ Kinetis KL2 Microcontroller IC 32-Bit 48MHz 64KB (64K x 8) FLASH 48-QFN (7x7); RAM Size: 8K x 8; Oscillator Type: Internal; Categories: Integrated Circuits (ICs)   Embedded - Microcontrollers; Core Processor: ARM® Cortex®-M0+; Core Size: 32-Bit; Speed: 48MHz; Connectivity: I²C, LINbus, SPI, UART/USART, USB, USB OTG; Peripherals: Brown-out Detect/Reset, DMA, I²S, LVD, POR, PWM, WDT; Number of I/O: 36; Program Memory: Type FLASH; Voltage - Supply (Vcc/Vdd): 1.71V ~ 3.6V; Data Converters: A/D - 16bit; D/A - 12bit; LibraryName: Teensy_DIY_v1.0; Part Status: Active; Operating Temperature: -40°C ~ 105°C (TA); Package / Case: 48-VFQFN Exposed Pad; Supplier Device Package: 48-QFN (7x7); Base Part Number: MKL26Z64; mfg P/N: MKL26Z64VFT4; Mounting Type: Surface Mount; Supplier 1: Digi-Key; Supplier Part Number 1: MKL26Z64VFT4-ND
U12 = OPAMP,20Mhz,MOSFET DRIVER,SOT23-5,LM7321MF: Single Rail-to-Rail Input/Output, ±15V, High Output Current and Unlimited Capacitive Load Operational Amplifier, 5-pin SOT-23, Pb-Free; Bandwidth: 20000000.0 Hz; Input Offset Drift: 2e-06 V/K; Lead-Free Status: Lead Free; Number of Channels: 1; Output Current: 0.06 A; Slew Rate: 18.0 V/μs; Case/Package: SOIC; Gain Bandwidth Product: 20000000.0 Hz; Lifecycle Status: Active; Mounting Style: Surface Mount; Number of Pins: 5; Packaging: Tape & Reel (TR); REACH SVHC Compliance: No SVHC; RoHS: Compliant; mfg P/N: LM7321MF/NOPB; Supplier 1: Digi-Key; Supplier Part Number 1: LM7321MF/NOPBCT-ND; Supplier 2: LCSC; Supplier Part Number 2: C128614
XTAL1 = resonator,crystal,SMD,stab15ppm,Tol,10ppm,7.2pf,80ohms,NX3225SA-16.000000MHZ-B3: CRYSTAL 16.0000MHZ 7.2PF SMD; Manufacturer: NDK America, Inc.; Detailed Description: 16MHz ±10ppm Crystal 7.2pF 80 Ohms 4-SMD, No Lead; Frequency: 16MHz; Frequency Stability: ±15ppm; Frequency Tolerance: ±10ppm; ESR (Equivalent Series Resistance): 80 Ohms; Operating Mode: Fundamental; Categories: Crystals, Oscillators, Resonators   Crystals; mfg P/N: NX3225SA-16.000000MHZ-B3; Series: NX3225SA; Part Status: Active; Type: MHz Crystal; Load Capacitance: 7.2pF; Operating Temperature: -30°C ~ 85°C; Mounting Type: Surface Mount; Package / Case: 4-SMD, No Lead; Size / Dimension: 0.126" L x 0.098" W (3.20mm x 2.50mm); Height - Seated (Max): 0.028" (0.70mm); Supplier 1: Digi-Key; Supplier Part Number 1: 644-1099-1-ND
J1-J4 = HEADER,0.1",8Pin,SinlgeRow: Supplier 1: Digi-Key; Supplier Part Number 1: S1011E-36-ND